# Altium schematic sheet Dash_v3.SchDoc
size 699 x 299 mm
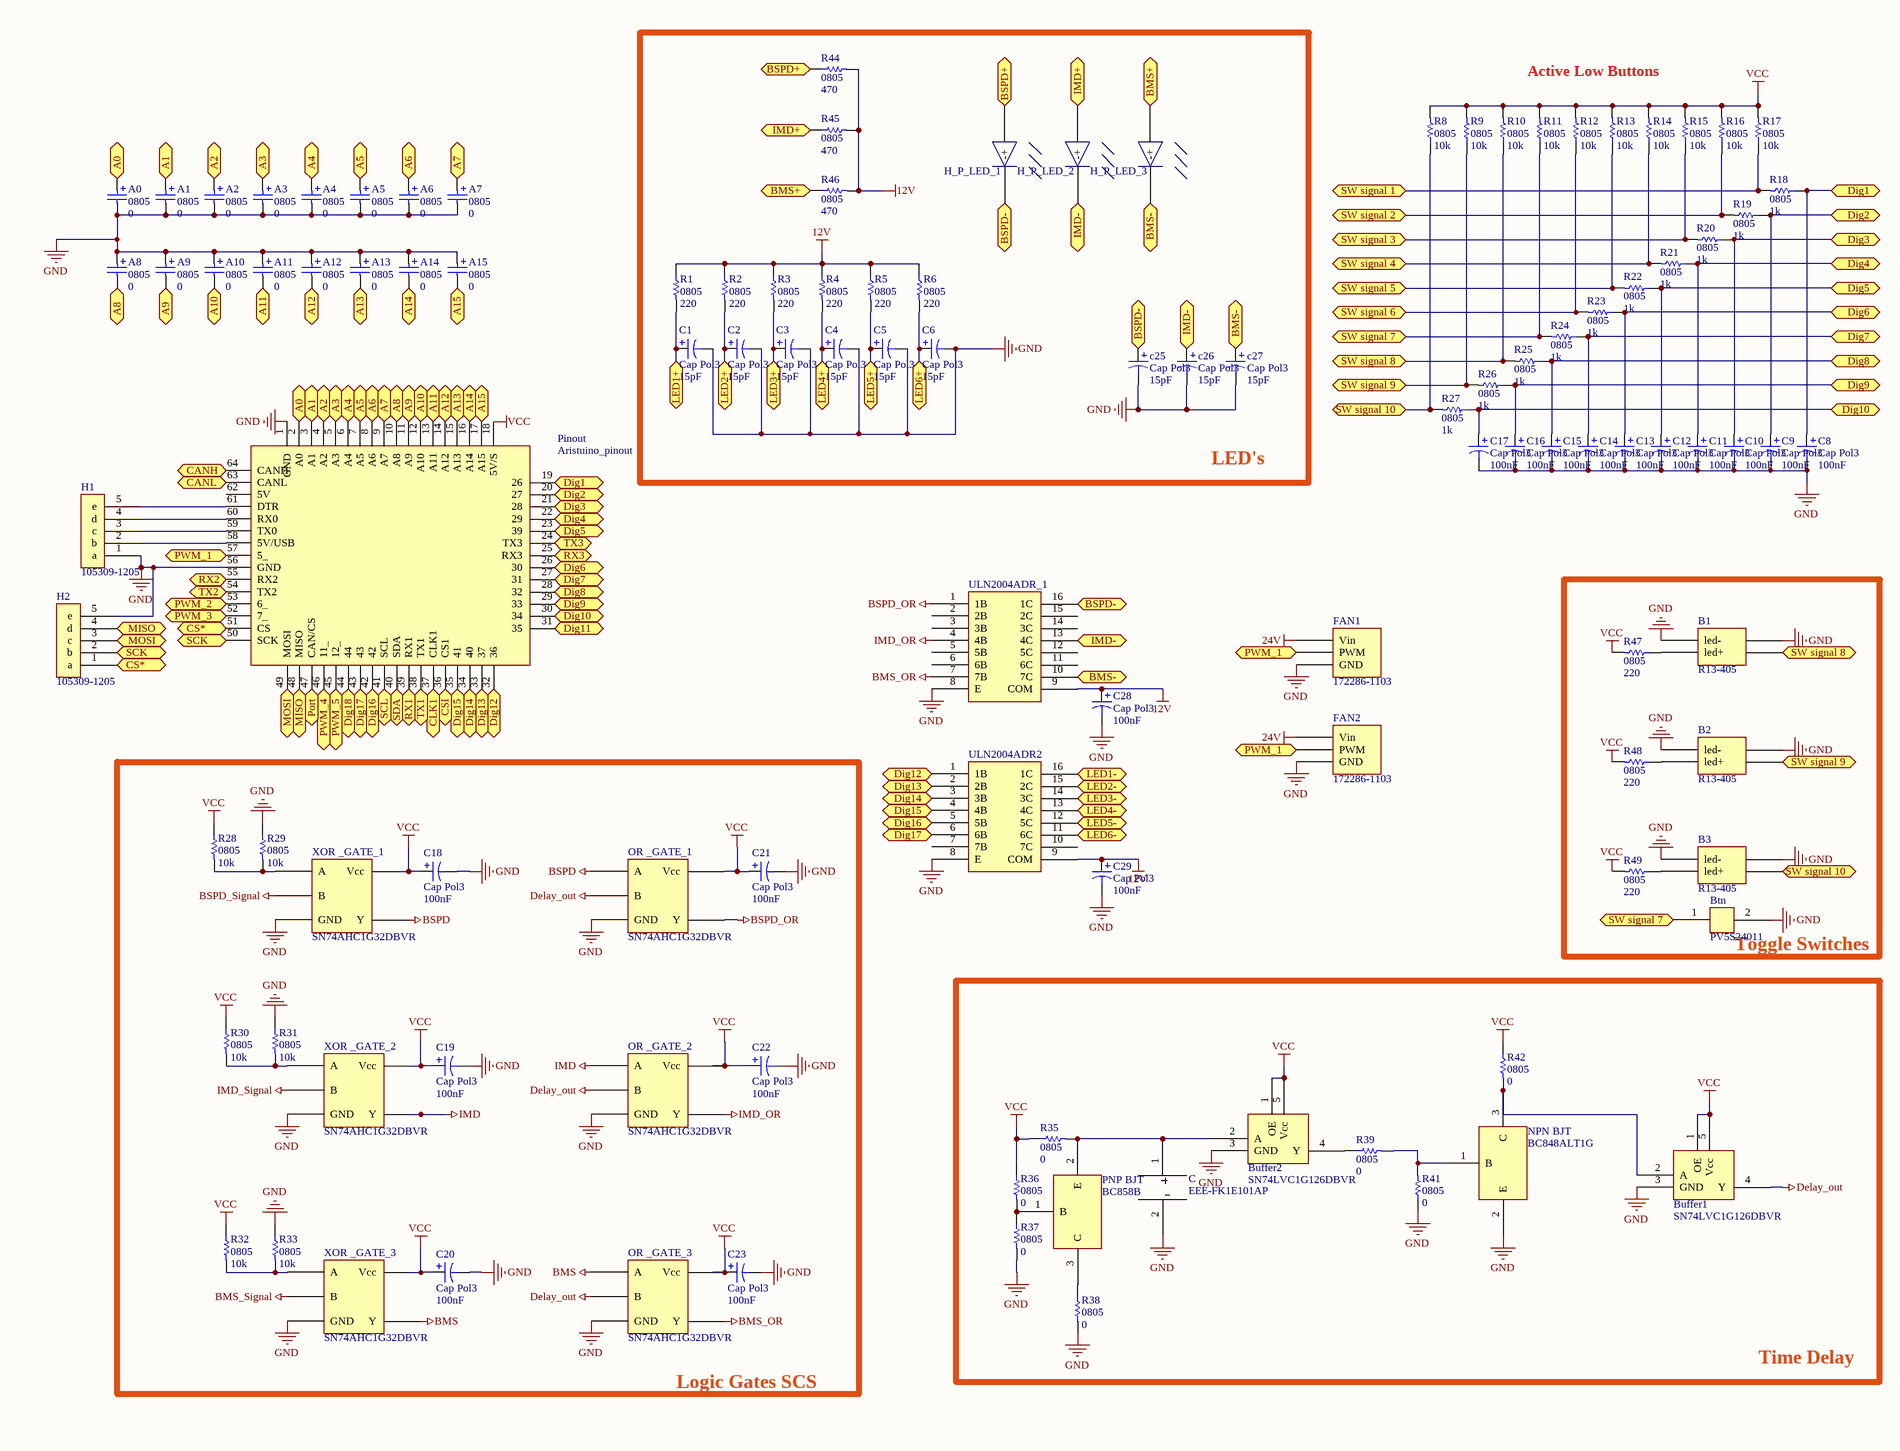
[diagram p0: Dash_v3.SchDoc, left]
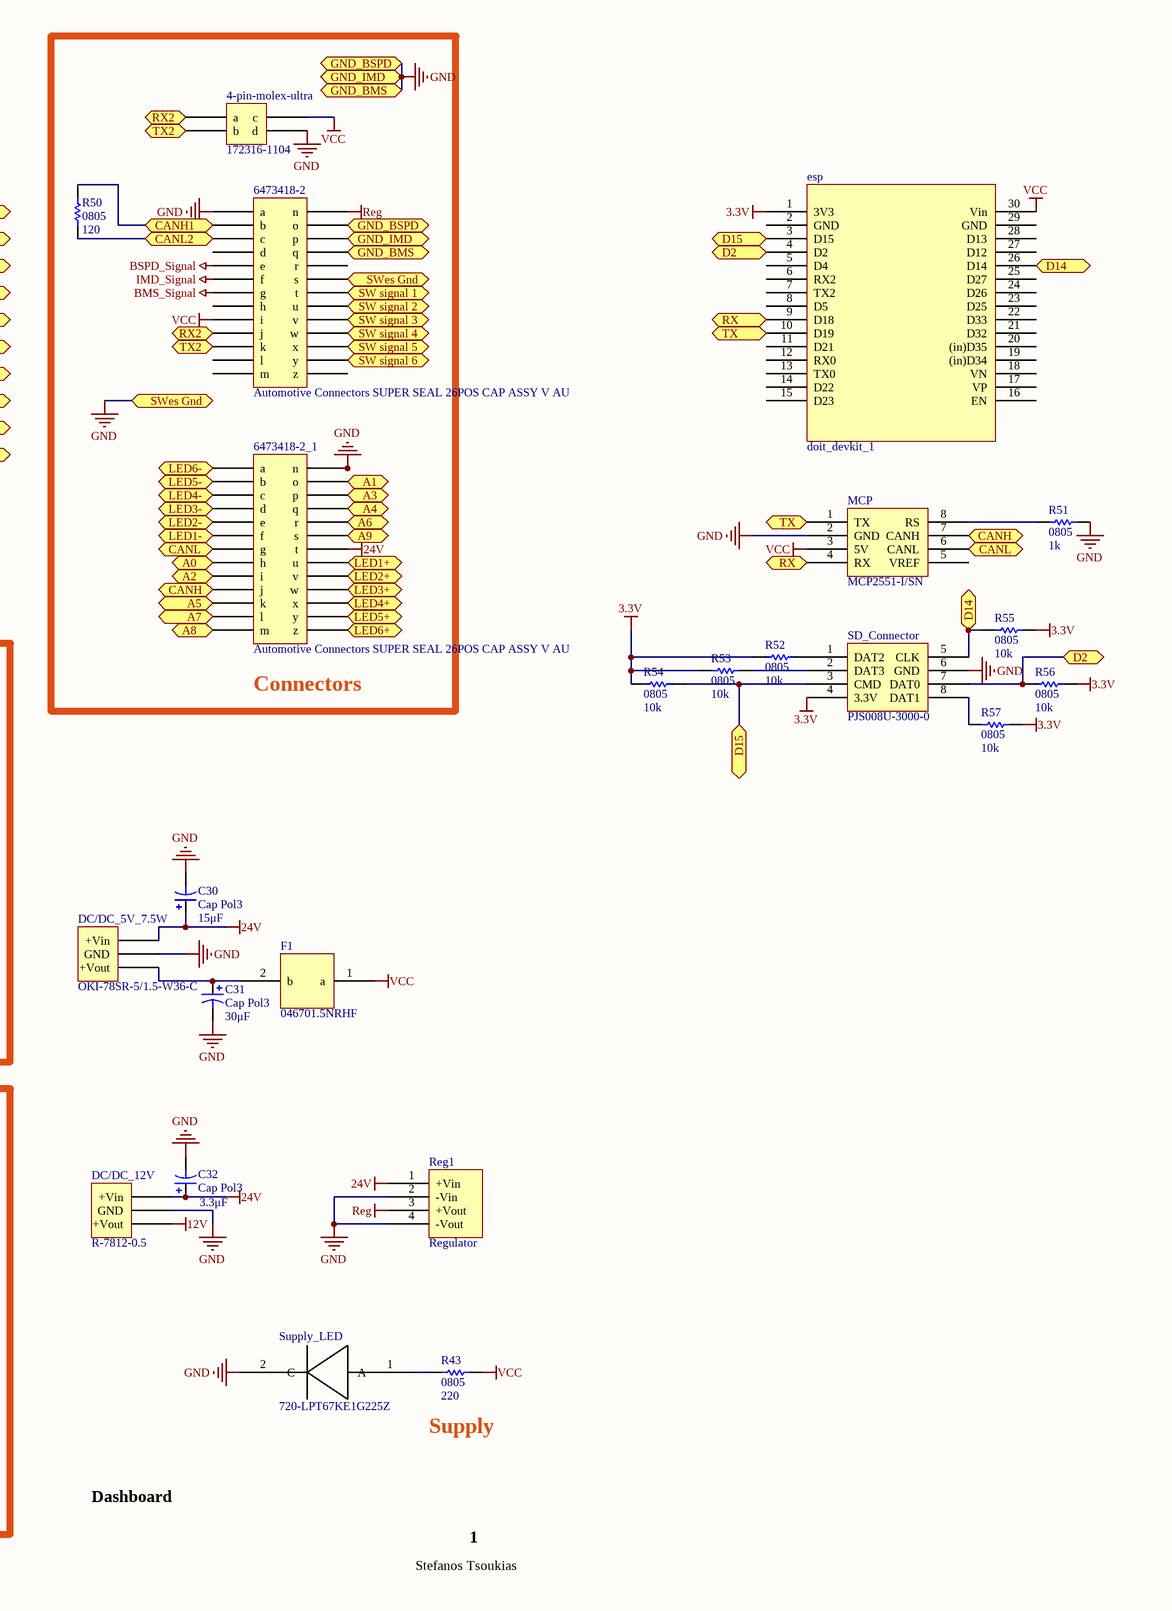
[diagram p1: Dash_v3.SchDoc, right]

## Parts
4-pin-molex-ultra  172316-1104  [PCBComponent_1]
6473418-2  Automotive Connectors SUPER SEAL 26POS CAP ASSY V AU  [6473418-2]
6473418-2_1  Automotive Connectors SUPER SEAL 26POS CAP ASSY V AU  [6473418-2]
A0  0805  value 0  [PCBComponent_1]
A1  0805  value 0  [PCBComponent_1]
A2  0805  value 0  [PCBComponent_1]
A3  0805  value 0  [PCBComponent_1]
A4  0805  value 0  [PCBComponent_1]
A5  0805  value 0  [PCBComponent_1]
A6  0805  value 0  [PCBComponent_1]
A7  0805  value 0  [PCBComponent_1]
A8  0805  value 0  [PCBComponent_1]
A9  0805  value 0  [PCBComponent_1]
A10  0805  value 0  [PCBComponent_1]
A11  0805  value 0  [PCBComponent_1]
A12  0805  value 0  [PCBComponent_1]
A13  0805  value 0  [PCBComponent_1]
A14  0805  value 0  [PCBComponent_1]
A15  0805  value 0  [PCBComponent_1]
B1  R13-405  [PCBComponent_1]
B2  R13-405  [PCBComponent_1]
B3  R13-405  [PCBComponent_1]
Btn  PV5S24011  [PV5S24011]
Buffer1  SN74LVC1G126DBVR  [SN74AHC1G32DBVR]
Buffer2  SN74LVC1G126DBVR  [SN74AHC1G32DBVR]
C  EEE-FK1E101AP  [CAPAE7084X65M]
C1  Cap Pol3  value 15pF  [CAPC2012X06N]
C2  Cap Pol3  value 15pF  [CAPC2012X06N]
C3  Cap Pol3  value 15pF  [CAPC2012X06N]
C4  Cap Pol3  value 15pF  [CAPC2012X06N]
C5  Cap Pol3  value 15pF  [CAPC2012X06N]
C6  Cap Pol3  value 15pF  [CAPC2012X06N]
C8  Cap Pol3  value 100nF  [CAPC2012X06N]
C9  Cap Pol3  value 100nF  [CAPC2012X06N]
C10  Cap Pol3  value 100nF  [CAPC2012X06N]
C11  Cap Pol3  value 100nF  [CAPC2012X06N]
C12  Cap Pol3  value 100nF  [CAPC2012X06N]
C13  Cap Pol3  value 100nF  [CAPC2012X06N]
C14  Cap Pol3  value 100nF  [CAPC2012X06N]
C15  Cap Pol3  value 100nF  [CAPC2012X06N]
C16  Cap Pol3  value 100nF  [CAPC2012X06N]
C17  Cap Pol3  value 100nF  [CAPC2012X06N]
C18  Cap Pol3  value 100nF  [CAPC2012X06N]
C19  Cap Pol3  value 100nF  [CAPC2012X06N]
C20  Cap Pol3  value 100nF  [CAPC2012X06N]
C21  Cap Pol3  value 100nF  [CAPC2012X06N]
C22  Cap Pol3  value 100nF  [CAPC2012X06N]
C23  Cap Pol3  value 100nF  [CAPC2012X06N]
c25  Cap Pol3  value 15pF  [CAPC2012X06N]
c26  Cap Pol3  value 15pF  [CAPC2012X06N]
c27  Cap Pol3  value 15pF  [CAPC2012X06N]
C28  Cap Pol3  value 100nF  [CAPC2012X06N]
C29  Cap Pol3  value 100nF  [CAPC2012X06N]
C30  Cap Pol3  value 15μF  [CAPC2012X06N]
C31  Cap Pol3  value 30μF  [CAPC2012X06N]
C32  Cap Pol3  value 3.3μF  [CAPC2012X06N]
DC/DC_5V_7.5W  OKI-78SR-5/1.5-W36-C  [OKI-78SR-5/1.5-W36-C]
DC/DC_12V  R-7812-0.5  [PCBComponent_1]
esp  doit_devkit_1  [PCBComponent_1]
F1  046701.5NRHF  [046701.5NRHF]
FAN1  172286-1103  [PCBComponent_1]
FAN2  172286-1103  [PCBComponent_1]
H1  105309-1205  [105309-1205]
H2  105309-1205  [105309-1205]
H_P_LED_1  LTH3MM12VFR4100  [H_P_LED_?]  (value not drawn)
H_P_LED_2  LTH3MM12VFR4100  [H_P_LED_?]  (value not drawn)
H_P_LED_3  LTH3MM12VFR4100  [H_P_LED_?]  (value not drawn)
MCP  MCP2551-I/SN  [SOIC127P600X175-8N]
NPN_BJT  BC848ALT1G  [NPN BJT]
OR__GATE_1  SN74AHC1G32DBVR  [SN74AHC1G32DBVR]
OR__GATE_2  SN74AHC1G32DBVR  [SN74AHC1G32DBVR]
OR__GATE_3  SN74AHC1G32DBVR  [SN74AHC1G32DBVR]
Pinout  Aristuino_pinout  [18x15 rectangular pin]
PNP_BJT  BC858B  [NPN BJT]
R1  0805  value 220  [RESC2012X06N]
R2  0805  value 220  [RESC2012X06N]
R3  0805  value 220  [RESC2012X06N]
R4  0805  value 220  [RESC2012X06N]
R5  0805  value 220  [RESC2012X06N]
R6  0805  value 220  [RESC2012X06N]
R8  0805  value 10k  [RESC2012X06N]
R9  0805  value 10k  [RESC2012X06N]
R10  0805  value 10k  [RESC2012X06N]
R11  0805  value 10k  [RESC2012X06N]
R12  0805  value 10k  [RESC2012X06N]
R13  0805  value 10k  [RESC2012X06N]
R14  0805  value 10k  [RESC2012X06N]
R15  0805  value 10k  [RESC2012X06N]
R16  0805  value 10k  [RESC2012X06N]
R17  0805  value 10k  [RESC2012X06N]
R18  0805  value 1k  [RESC2012X06N]
R19  0805  value 1k  [RESC2012X06N]
R20  0805  value 1k  [RESC2012X06N]
R21  0805  value 1k  [RESC2012X06N]
R22  0805  value 1k  [RESC2012X06N]
R23  0805  value 1k  [RESC2012X06N]
R24  0805  value 1k  [RESC2012X06N]
R25  0805  value 1k  [RESC2012X06N]
R26  0805  value 1k  [RESC2012X06N]
R27  0805  value 1k  [RESC2012X06N]
R28  0805  value 10k  [RESC2012X06N]
R29  0805  value 10k  [RESC2012X06N]
R30  0805  value 10k  [RESC2012X06N]
R31  0805  value 10k  [RESC2012X06N]
R32  0805  value 10k  [RESC2012X06N]
R33  0805  value 10k  [RESC2012X06N]
R35  0805  value 0  [RESC2012X06N]
R36  0805  value 0  [RESC2012X06N]
R37  0805  value 0  [RESC2012X06N]
R38  0805  value 0  [RESC2012X06N]
R39  0805  value 0  [RESC2012X06N]
R41  0805  value 0  [RESC2012X06N]
R42  0805  value 0  [RESC2012X06N]
R43  0805  value 220  [RESC2012X06N]
R44  0805  value 470  [RESC2012X06N]
R45  0805  value 470  [RESC2012X06N]
R46  0805  value 470  [RESC2012X06N]
R47  0805  value 220  [RESC2012X06N]
R48  0805  value 220  [RESC2012X06N]
R49  0805  value 220  [RESC2012X06N]
R50  0805  value 120  [RESC2012X06N]
R51  0805  value 1k  [RESC2012X06N]
R52  0805  value 10k  [RESC2012X06N]
R53  0805  value 10k  [RESC2012X06N]
R54  0805  value 10k  [RESC2012X06N]
R55  0805  value 10k  [RESC2012X06N]
R56  0805  value 10k  [RESC2012X06N]
R57  0805  value 10k  [RESC2012X06N]
Reg1  Regulator  [regulator]
SD_Connector  PJS008U-3000-0  [PCBComponent_1]
Supply_LED  720-LPT67KE1G225Z  [SMD LED]
ULN2004ADR2  Darlington Transistors Hi-Vltg Hi-Crnt Darl Transistor Arrays  [ULN2004ADR]  (value not drawn)
ULN2004ADR_1  Darlington Transistors Hi-Vltg Hi-Crnt Darl Transistor Arrays  [ULN2004ADR]  (value not drawn)
XOR__GATE_1  SN74AHC1G32DBVR  [SN74AHC1G32DBVR]
XOR__GATE_2  SN74AHC1G32DBVR  [SN74AHC1G32DBVR]
XOR__GATE_3  SN74AHC1G32DBVR  [SN74AHC1G32DBVR]

## Blocks framed on the sheet
LED's: C1-C6 c25-c27 H_P_LED_1-H_P_LED_3 R1-R6 R44-R46
Connectors: 4-pin-molex-ultra 6473418-2 6473418-2_1 R50
Toggle Switches: B1-B3 Btn R47-R49
Logic Gates SCS: C18-C23 OR__GATE_1-OR__GATE_3 R28-R33 XOR__GATE_1-XOR__GATE_3
Time Delay: Buffer1 Buffer2 C NPN_BJT PNP_BJT R35-R39 R41 R42

## Ports
A0, A1, A2, A3, A4, A5, A6, A7, A8, A9, A10, A11, A12, A13, A14, A15, BMS+, BMS-, BSPD+, BSPD-, CANH, CANH1, CANL, CANL2, CLK1, CS*, CSI, D2, D14, D15, Dig1, Dig2, Dig3, Dig4, Dig5, Dig6, Dig7, Dig8, Dig9, Dig10, Dig11, Dig12, Dig13, Dig14, Dig15, Dig16, Dig17, Dig18, GND_BMS, GND_BSPD, GND_IMD, IMD+, IMD-, LED1+, LED1-, LED2+, LED2-, LED3+, LED3-, LED4+, LED4-, LED5+, LED5-, LED6+, LED6-, MISO, MOSI, Port, PWM_1, PWM_2, PWM_3, PWM_4, PWM_5, RX, RX1, RX2, RX3, SCK, SCL, SDA, SW signal 1, SW signal 2, SW signal 3, SW signal 4, SW signal 5, SW signal 6, SW signal 7, SW signal 8, SW signal 9, SW signal 10, SWes Gnd, TX, TX1, TX2, TX3

## Nets
3.3V: esp.1(3V3) R52.2 R53.2 R54.2 R55.1 R56.1 R57.1 SD_Connector.4(3.3V)
12V: C28.1 C29.1 DC/DC_12V.3(+Vout) R1.1 R2.1 R3.1 R4.1 R5.1 R6.1 R44.2 R45.2 R46.2 ULN2004ADR2.9(COM) ULN2004ADR_1.9(COM)
24V: 6473418-2_1.20(t) C30.1 C32.1 DC/DC_5V_7.5W.1(+Vin) DC/DC_12V.1(+Vin) FAN1.1(Vin) FAN2.1(Vin) Reg1.1(+Vin)
BMS: OR__GATE_3.1(A) XOR__GATE_3.5(Y)
BMS_OR: OR__GATE_3.5(Y) ULN2004ADR_1.7(7B)
BMS_Signal: 6473418-2.7(g) XOR__GATE_3.2(B)
BSPD: OR__GATE_1.1(A) XOR__GATE_1.5(Y)
BSPD_OR: OR__GATE_1.5(Y) ULN2004ADR_1.1(1B)
BSPD_Signal: 6473418-2.5(e) XOR__GATE_1.2(B)
Delay_out: Buffer1.4(Y) OR__GATE_1.2(B) OR__GATE_2.2(B) OR__GATE_3.2(B)
GND: 4-pin-molex-ultra.4(d) 6473418-2.1(a) 6473418-2.15(o) 6473418-2.16(p) 6473418-2.17(q) 6473418-2.19(s) 6473418-2_1.14(n) A0.2 A1.2 A2.2 A3.2 A4.2 A5.2 A6.2 A7.2 A8.1 A9.1 A10.1 A11.1 A12.1 A13.1 A14.1 A15.1 B1.2 B1.4(led-) B2.2 B2.4(led-) B3.2 B3.4(led-) Btn.2 Buffer1.3(GND) Buffer2.3(GND) C.2 C1.2 C2.2 C3.2 C4.2 C5.2 C6.2 C8.2 C9.2 C10.2 C11.2 C12.2 C13.2 C14.2 C15.2 C16.2 C17.2 C18.2 C19.2 C20.2 C21.2 C22.2 C23.2 c25.2 c26.2 c27.2 C28.2 C29.2 C30.2 C31.2 C32.2 DC/DC_5V_7.5W.2(GND) DC/DC_12V.2(GND) FAN1.3(GND) FAN2.3(GND) H1.1(a) H2.5(e) MCP.2(GND) NPN_BJT.2(E) OR__GATE_1.3(GND) OR__GATE_2.3(GND) OR__GATE_3.3(GND) Pinout.1(GND) Pinout.56(GND) R29.1 R31.1 R33.1 R37.2 R38.2 R41.1 R51.1 Reg1.2(-Vin) Reg1.4(-Vout) SD_Connector.6(GND) Supply_LED.2(C) ULN2004ADR2.8(E) ULN2004ADR_1.8(E) XOR__GATE_1.3(GND) XOR__GATE_2.3(GND) XOR__GATE_3.3(GND) ; port SWes Gnd, port GND_BSPD, port GND_IMD, port GND_BMS
IMD: OR__GATE_2.1(A) XOR__GATE_2.5(Y)
IMD_OR: OR__GATE_2.5(Y) ULN2004ADR_1.4(4B)
IMD_Signal: 6473418-2.6(f) XOR__GATE_2.2(B)
Reg: 6473418-2.14(n) Reg1.3(+Vout)
VCC: 4-pin-molex-ultra.3(c) 6473418-2.9(i) Buffer1.1(OE) Buffer1.5(Vcc) Buffer2.1(OE) Buffer2.5(Vcc) C18.1 C19.1 C20.1 C21.1 C22.1 C23.1 esp.30(Vin) F1.1(a) MCP.3(5V) OR__GATE_1.4(Vcc) OR__GATE_2.4(Vcc) OR__GATE_3.4(Vcc) Pinout.18(5V/S) R8.2 R9.2 R10.2 R11.2 R12.2 R13.2 R14.2 R15.2 R16.2 R17.2 R28.1 R30.1 R32.1 R35.1 R36.1 R42.1 R43.1 R47.2 R48.2 R49.2 XOR__GATE_1.4(Vcc) XOR__GATE_2.4(Vcc) XOR__GATE_3.4(Vcc)
A0: 6473418-2_1.8(h) A0.1 Pinout.2(A0) ; port A0
A1: 6473418-2_1.15(o) A1.1 Pinout.3(A1) ; port A1
A2: 6473418-2_1.9(i) A2.1 Pinout.4(A2) ; port A2
A3: 6473418-2_1.16(p) A3.1 Pinout.5(A3) ; port A3
A4: 6473418-2_1.17(q) A4.1 Pinout.6(A4) ; port A4
A5: 6473418-2_1.11(k) A5.1 Pinout.7(A5) ; port A5
A6: 6473418-2_1.18(r) A6.1 Pinout.8(A6) ; port A6
A7: 6473418-2_1.12(l) A7.1 Pinout.9(A7) ; port A7
A8: 6473418-2_1.13(m) A8.2 Pinout.10(A8) ; port A8
A9: 6473418-2_1.19(s) A9.2 Pinout.11(A9) ; port A9
A10: A10.2 Pinout.12(A10) ; port A10
A11: A11.2 Pinout.13(A11) ; port A11
A12: A12.2 Pinout.14(A12) ; port A12
A13: A13.2 Pinout.15(A13) ; port A13
A14: A14.2 Pinout.16(A14) ; port A14
A15: A15.2 Pinout.17(A15) ; port A15
BMS+: H_P_LED_3.1(+) R46.1 ; port BMS+
BMS-: c27.1 H_P_LED_3.2(-) ULN2004ADR_1.10(7C) ; port BMS-
BSPD+: H_P_LED_1.1(+) R44.1 ; port BSPD+
BSPD-: c25.1 H_P_LED_1.2(-) ULN2004ADR_1.16(1C) ; port BSPD-
CANH: 6473418-2_1.10(j) MCP.7(CANH) Pinout.64(CANH) ; port CANH
CANH1: 6473418-2.2(b) R50.1 ; port CANH1
CANL: 6473418-2_1.7(g) MCP.6(CANL) Pinout.63(CANL) ; port CANL
CANL2: 6473418-2.3(c) R50.2 ; port CANL2
CLK1: Pinout.37(CLK1) ; port CLK1
CS*: H2.1(a) Pinout.51(CS) ; port CS*
CSI: Pinout.36(CS1) ; port CSI
D2: esp.4(D2) R56.2 SD_Connector.7(DAT0) ; port D2
D14: esp.26(D14) R55.2 SD_Connector.5(CLK) ; port D14
D15: esp.3(D15) R54.1 SD_Connector.3(CMD) ; port D15
Dig1: C8.1 Pinout.19(26) R18.1 ; port Dig1
Dig2: C9.1 Pinout.20(27) R19.1 ; port Dig2
Dig3: C10.1 Pinout.21(28) R20.1 ; port Dig3
Dig4: C11.1 Pinout.22(29) R21.1 ; port Dig4
Dig5: C12.1 Pinout.23(39) R22.1 ; port Dig5
Dig6: C13.1 Pinout.26(30) R23.1 ; port Dig6
Dig7: C14.1 Pinout.27(31) R24.1 ; port Dig7
Dig8: C15.1 Pinout.28(32) R25.1 ; port Dig8
Dig9: C16.1 Pinout.29(33) R26.1 ; port Dig9
Dig10: C17.1 Pinout.30(34) R27.1 ; port Dig10
Dig11: Pinout.31(35) ; port Dig11
Dig12: Pinout.32(36) ULN2004ADR2.1(1B) ; port Dig12
Dig13: Pinout.33(37) ULN2004ADR2.2(2B) ; port Dig13
Dig14: Pinout.34(40) ULN2004ADR2.3(3B) ; port Dig14
Dig15: Pinout.35(41) ULN2004ADR2.4(4B) ; port Dig15
Dig16: Pinout.42 ULN2004ADR2.5(5B) ; port Dig16
Dig17: Pinout.43 ULN2004ADR2.6(6B) ; port Dig17
Dig18: Pinout.44 ; port Dig18
IMD+: H_P_LED_2.1(+) R45.1 ; port IMD+
IMD-: c26.1 H_P_LED_2.2(-) ULN2004ADR_1.13(4C) ; port IMD-
LED1+: 6473418-2_1.21(u) C1.1 R1.2 ; port LED1+
LED1-: 6473418-2_1.6(f) ULN2004ADR2.16(1C) ; port LED1-
LED2+: 6473418-2_1.22(v) C2.1 R2.2 ; port LED2+
LED2-: 6473418-2_1.5(e) ULN2004ADR2.15(2C) ; port LED2-
LED3+: 6473418-2_1.23(w) C3.1 R3.2 ; port LED3+
LED3-: 6473418-2_1.4(d) ULN2004ADR2.14(3C) ; port LED3-
LED4+: 6473418-2_1.24(x) C4.1 R4.2 ; port LED4+
LED4-: 6473418-2_1.3(c) ULN2004ADR2.13(4C) ; port LED4-
LED5+: 6473418-2_1.25(y) C5.1 R5.2 ; port LED5+
LED5-: 6473418-2_1.2(b) ULN2004ADR2.12(5C) ; port LED5-
LED6+: 6473418-2_1.26(z) C6.1 R6.2 ; port LED6+
LED6-: 6473418-2_1.1(a) ULN2004ADR2.11(6C) ; port LED6-
MISO: H2.4(d) Pinout.48(MISO) ; port MISO
MOSI: H2.3(c) Pinout.49(MOSI) ; port MOSI
Port: Pinout.47(CAN/CS) ; port Port
PWM_1: FAN1.2(PWM) FAN2.2(PWM) Pinout.57(5_) ; port PWM_1
PWM_2: Pinout.53(6_) ; port PWM_2
PWM_3: Pinout.52(7_) ; port PWM_3
PWM_4: Pinout.46(11_) ; port PWM_4
PWM_5: Pinout.45(12_) ; port PWM_5
RX: esp.9(D18) MCP.4(RX) ; port RX
RX1: Pinout.39(RX1) ; port RX1
RX2: 4-pin-molex-ultra.1(a) 6473418-2.10(j) Pinout.55(RX2) ; port RX2
RX3: Pinout.25(RX3) ; port RX3
SCK: H2.2(b) Pinout.50(SCK) ; port SCK
SCL: Pinout.41(SCL) ; port SCL
SDA: Pinout.40(SDA) ; port SDA
SW signal 1: 6473418-2.20(t) R17.1 R18.2 ; port SW signal 1
SW signal 2: 6473418-2.21(u) R16.1 R19.2 ; port SW signal 2
SW signal 3: 6473418-2.22(v) R15.1 R20.2 ; port SW signal 3
SW signal 4: 6473418-2.23(w) R14.1 R21.2 ; port SW signal 4
SW signal 5: 6473418-2.24(x) R13.1 R22.2 ; port SW signal 5
SW signal 6: 6473418-2.25(y) R12.1 R23.2 ; port SW signal 6
SW signal 7: Btn.1 R11.1 R24.2 ; port SW signal 7
SW signal 8: B1.1 R10.1 R25.2 ; port SW signal 8
SW signal 9: B2.1 R9.1 R26.2 ; port SW signal 9
SW signal 10: B3.1 R8.1 R27.2 ; port SW signal 10
TX: esp.10(D19) MCP.1(TX) ; port TX
TX1: Pinout.38(TX1) ; port TX1
TX2: 4-pin-molex-ultra.2(b) 6473418-2.11(k) Pinout.54(TX2) ; port TX2
TX3: Pinout.24(TX3) ; port TX3
NetB1_3: B1.3(led+) R47.1
NetB2_3: B2.3(led+) R48.1
NetB3_3: B3.3(led+) R49.1
NetBuffer1_2: Buffer1.2(A) NPN_BJT.3(C) R42.2
NetBuffer2_2: Buffer2.2(A) C.1 PNP_BJT.2(E) R35.2
NetBuffer2_4: Buffer2.4(Y) R39.1
NetC31_1: C31.1 DC/DC_5V_7.5W.3(+Vout) F1.2(b)
NetH1_2: H1.2(b) Pinout.58(5V/USB)
NetH1_3: H1.3(c) Pinout.59(TX0)
NetH1_4: H1.4(d) Pinout.60(RX0)
NetH1_5: H1.5(e) Pinout.61(DTR)
NetMCP_8: MCP.8(RS) R51.2
NetNPN_BJT_1: NPN_BJT.1(B) R39.2 R41.2
NetPNP_BJT_1: PNP_BJT.1(B) R36.2 R37.1
NetPNP_BJT_3: PNP_BJT.3(C) R38.1
NetR28_2: R28.2 R29.2 XOR__GATE_1.1(A)
NetR30_2: R30.2 R31.2 XOR__GATE_2.1(A)
NetR32_2: R32.2 R33.2 XOR__GATE_3.1(A)
NetR43_2: R43.2 Supply_LED.1(A)
NetR52_1: R52.1 SD_Connector.1(DAT2)
NetR53_1: R53.1 SD_Connector.2(DAT3)
NetR57_2: R57.2 SD_Connector.8(DAT1)

Not connected (* = marked no-connect by the designer): 6473418-2 4(d) 8(h) 12(l) 13(m) 18(r) 26(z); esp 2(GND) 5(D4) 6(RX2) 7(TX2) 8(D5) 11(D21) 12(RX0) 13(TX0) 14(D22) 15(D23) 16(EN) 17(VP) 18(VN) 19((in)D34) 20((in)D35) 21(D32) 22(D33) 23(D25) 24(D26) 25(D27) 27(D12) 28(D13) 29(GND); MCP 5(VREF); Pinout 62(5V); ULN2004ADR2 7(7B) 10(7C); ULN2004ADR_1 2(2B) 3(3B) 5(5B) 6(6B) 11(6C) 12(5C) 14(3C) 15(2C)

## Notes on the sheet
- Active Low Buttons
- (near R43) Supply
- Dashboard
- 1
- Stefanos Tsoukias

## Library data of the parts
4-pin-molex-ultra = Component_1: Headers & Wire Housings ULTRAFIT 3.5MM 4CKT HDR R/A D/R BLK TIN
6473418-2 6473418-2_1 B1-B3 esp OR__GATE_1-OR__GATE_3 ULN2004ADR2 ULN2004ADR_1 XOR__GATE_1-XOR__GATE_3 = Component_1
A0-A15 = Cap Pol2: Polarized Capacitor (Axial); Published: 8-Jun-2000; LatestRevisionDate: 17-Jul-2002; LatestRevisionNote: Re-released for DXP Platform.; PackageReference: POLAR0.8; Publisher: Altium Limited; PackageDescription: Polarized Capacitor; 2 Leads
Btn = Component_1: Pushbutton Switches 0-2A 48VDC Off (On) 12mm Black Domed
Buffer1 Buffer2 = SN74LVC1G126DBVR: Buffers & Line Drivers Single Bus Buffer
C = EEE-FK1E101AP: Aluminium Electrolytic Capacitors - SMD 100UF 25V FK SMD
C1-C6 C8-C23 c25-c27 C28-C32 = Cap Pol3: Polarized Capacitor (Surface Mount); Published: 8-Jun-2000; LatestRevisionDate: 29-May-2009; LatestRevisionNote: IPC-7351 Footprint Added.; PackageReference: C0805; Publisher: Altium Limited; PackageDescription: Chip Capacitor
DC/DC_5V_7.5W = Component_1: Non-Isolated DC/DC Converters 7.5W 24Vin 5Vout1 1.5A SIP Non-Iso
DC/DC_12V = Component_1: Non-Isolated DC/DC Converters 0.5A DC/DC REG 15-34Vin 12Vout
F1 = 046701.5NRHF: Surface Mount Fuses 32V 1.5 A V/FA HALIDE FREE
FAN1 FAN2 = Component_1: Ultra-Fit Vertical Header, 3.50mm Pitch, Single Row, 3 Circuits, with Kinked Pins, Tin, Glow Wire Capable, Black
H1 H2 = 105309-1205: molex 2.5 5pin 1 row
H_P_LED_1-H_P_LED_3 = Component_1: Standard LEDs - Through Hole 3mm Thru Hole LED 625nm for 12VDC
MCP = Component_1: CAN Interface IC Hi Spd CAN Transceiv
NPN_BJT = Component_1: Bipolar Transistors - BJT 100mA 30V NPN
PNP_BJT = Component_1: Bipolar Transistors - BJT Transistor 200mW
R1-R6 R8-R33 R35-R39 R41-R57 = ERJ6RB: Precision Thick Film Chip Resistor, 10 Ohm to 1M Ohm Range, 1% and 0.5% Tolerance, 0805 Size, 0.1 W; Published: 17-Dec-2003; LatestRevisionDate: 19-Mar-2004; LatestRevisionNote: Silkscreen size reduced.; PackageDocument: Mar-2003; PackageReference: 6-0805; Publisher: Altium Limited; Code_IPC: 2012 [0805]; ComponentLink1Description: Manufacturer Link; ComponentLink1URL: http://www.panasonic.com/industrial/components/resistive_products.htm; ComponentLink2Description: Datasheet; ComponentLink2URL: http://www.panasonic.com/industrial/components/pdf/AOA0000CE2.pdf
Reg1 = LM2596: LM2596-step down regulator
SD_Connector = Component_1: Memory Card Connectors MicroSD Card Conn Ver Dip Mnt Manual
Supply_LED = 720-LPT67KE1G225Z: Standard LEDs - SMD Pure Green, 560nm 2.8mcd, 2mA